# Altium project QSFP28 Mezzanine.PrjPcb (part 3 of 4)

## Sheet [08] - QSFP28_2.SchDoc: QSFP28 Module
size A3; Engineer: *ORCEL THYS; DocumentNumber: 5; SheetNumber: 5; SheetTotal: 14
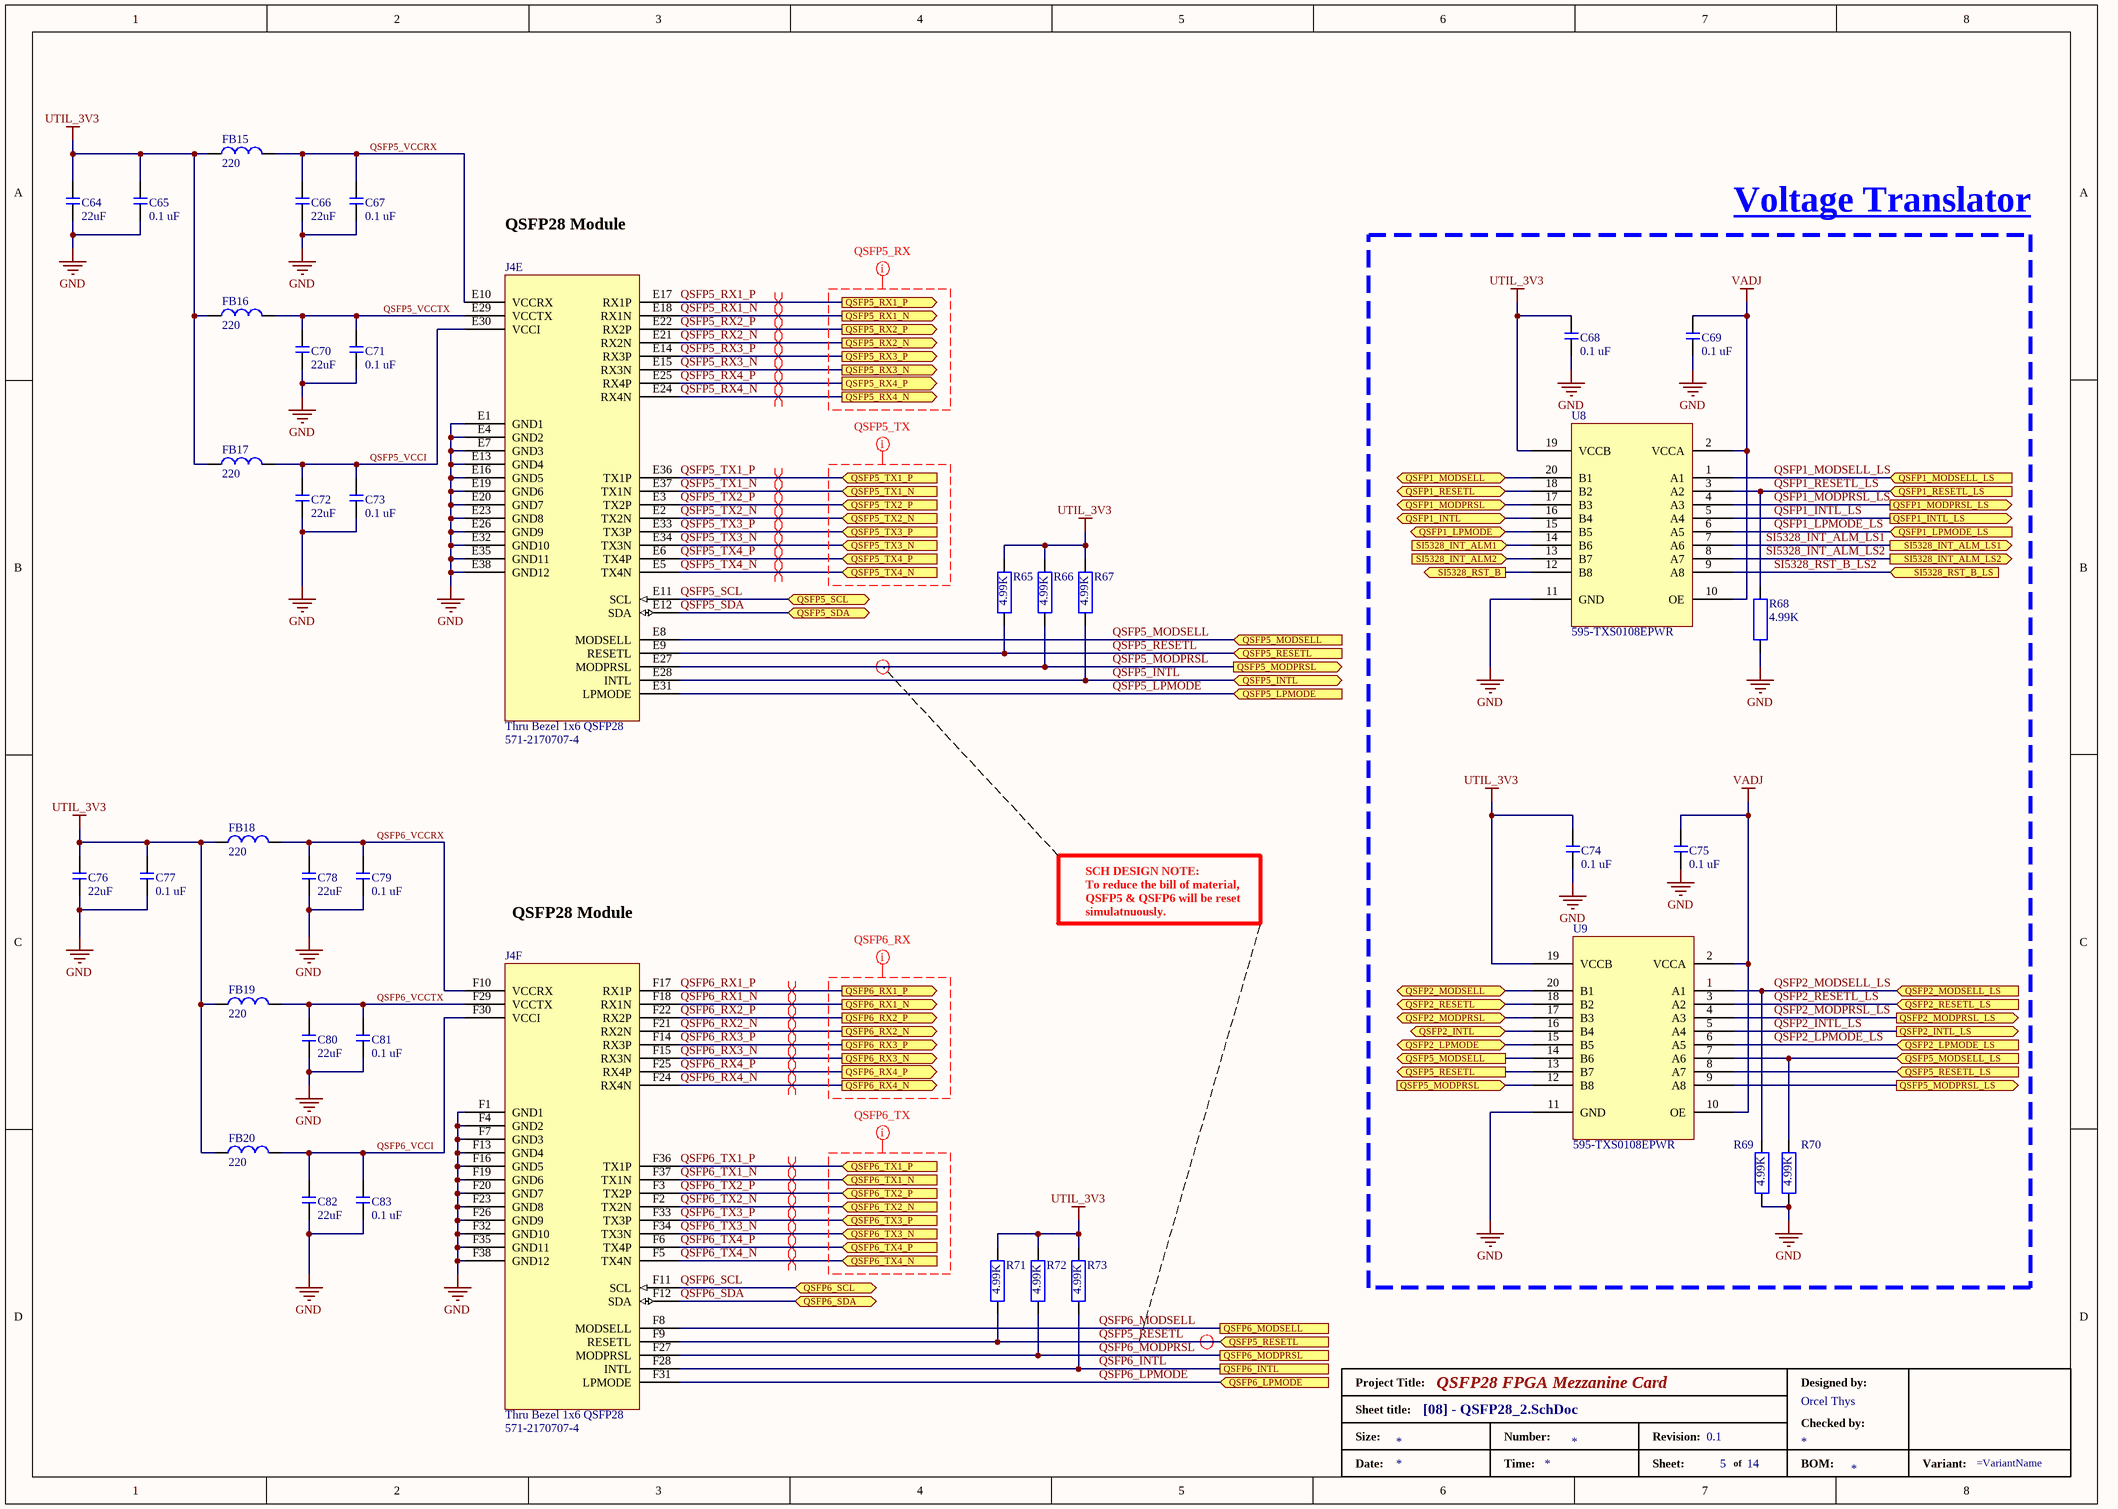
[diagram p7: [08] - QSFP28_2.SchDoc]

### Parts
(Parts that share a designator on the sheet are numbered #1, #2 ... from top to bottom, then left to right.)
*#9  DesignedBy: Orcel Thys  (hidden comment: Standard Title Block)  (graphical)
C64  22uF  [C2012]
C65  0.1 uF  [C0402]
C66  22uF  [C2012]
C67  0.1 uF  [C0402]
C68  0.1 uF  [C0402]
C69  0.1 uF  [C0402]
C70  22uF  [C2012]
C71  0.1 uF  [C0402]
C72  22uF  [C2012]
C73  0.1 uF  [C0402]
C74  0.1 uF  [C0402]
C75  0.1 uF  [C0402]
C76  22uF  [C2012]
C77  0.1 uF  [C0402]
C78  22uF  [C2012]
C79  0.1 uF  [C0402]
C80  22uF  [C2012]
C81  0.1 uF  [C0402]
C82  22uF  [C2012]
C83  0.1 uF  [C0402]
FB15  220  [BEADC1608X75N]
FB16  220  [BEADC1608X75N]
FB17  220  [BEADC1608X75N]
FB18  220  [BEADC1608X75N]
FB19  220  [BEADC1608X75N]
FB20  220  [BEADC1608X75N]
J4  Thru Bezel 1x6 QSFP28  Supplier Part Number 1: 571-2170707-4  [TE_2170707-4]  (parts E,F of 7)
R65  4.99K  [R0402]
R66  4.99K  [R0402]
R67  4.99K  [R0402]
R68  4.99K  [R0402]
R69  4.99K  [R0402]
R70  4.99K  [R0402]
R71  4.99K  [R0402]
R72  4.99K  [R0402]
R73  4.99K  [R0402]
U8  Supplier Part Number 1: 595-TXS0108EPWR  [SOP_65P640X120-20N]  (hidden comment: 8-bit voltage translator)
U9  Supplier Part Number 1: 595-TXS0108EPWR  [SOP_65P640X120-20N]  (hidden comment: 8-bit voltage translator)

### Blocks framed on the sheet
Voltage Translator: C68 C69 C74 C75 R68-R70 U8 U9

### Ports
QSFP1_INTL (bidir), QSFP1_INTL_LS (out), QSFP1_LPMODE (bidir), QSFP1_LPMODE_LS (in), QSFP1_MODPRSL (bidir), QSFP1_MODPRSL_LS (out), QSFP1_MODSELL (bidir), QSFP1_MODSELL_LS (in), QSFP1_RESETL (bidir), QSFP1_RESETL_LS (in), QSFP2_INTL (bidir), QSFP2_INTL_LS (out), QSFP2_LPMODE (bidir), QSFP2_LPMODE_LS (in), QSFP2_MODPRSL (bidir), QSFP2_MODPRSL_LS (out), QSFP2_MODSELL (bidir), QSFP2_MODSELL_LS (in), QSFP2_RESETL (bidir), QSFP2_RESETL_LS (in), QSFP5_INTL (bidir), QSFP5_LPMODE (in), QSFP5_MODPRSL (in), QSFP5_MODPRSL (out), QSFP5_MODPRSL_LS (out), QSFP5_MODSELL (in), QSFP5_MODSELL (out), QSFP5_MODSELL_LS (in), QSFP5_RESETL (in), QSFP5_RESETL (out), QSFP5_RESETL_LS (in), QSFP5_RX1_N (out), QSFP5_RX1_P (out), QSFP5_RX2_N (out), QSFP5_RX2_P (out), QSFP5_RX3_N (out), QSFP5_RX3_P (out), QSFP5_RX4_N (out), QSFP5_RX4_P (out), QSFP5_SCL (bidir), QSFP5_SDA (bidir), QSFP5_TX1_N (in), QSFP5_TX1_P (in), QSFP5_TX2_N (in), QSFP5_TX2_P (in), QSFP5_TX3_N (in), QSFP5_TX3_P (in), QSFP5_TX4_N (in), QSFP5_TX4_P (in), QSFP6_INTL, QSFP6_LPMODE (in), QSFP6_MODPRSL, QSFP6_MODSELL, QSFP6_RX1_N (out), QSFP6_RX1_P (out), QSFP6_RX2_N (out), QSFP6_RX2_P (out), QSFP6_RX3_N (out), QSFP6_RX3_P (out), QSFP6_RX4_N (out), QSFP6_RX4_P (out), QSFP6_SCL (bidir), QSFP6_SDA (bidir), QSFP6_TX1_N (in), QSFP6_TX1_P (in), QSFP6_TX2_N (in), QSFP6_TX2_P (in), QSFP6_TX3_N (in), QSFP6_TX3_P (in), QSFP6_TX4_N (in), QSFP6_TX4_P (in), SI5328_INT_ALM1 (in), SI5328_INT_ALM2 (in), SI5328_INT_ALM_LS1 (out), SI5328_INT_ALM_LS2 (out), SI5328_RST_B (out), SI5328_RST_B_LS (in)

### Nets
GND: C64.1 C65.1 C66.1 C67.1 C68.2 C69.1 C70.1 C71.1 C72.1 C73.1 C74.1 C75.1 C76.1 C77.1 C78.1 C79.1 C80.1 C81.1 C82.1 C83.1 J4.E1(GND1) J4.E4(GND2) J4.E7(GND3) J4.E13(GND4) J4.E16(GND5) J4.E19(GND6) J4.E20(GND7) J4.E23(GND8) J4.E26(GND9) J4.E32(GND10) J4.E35(GND11) J4.E38(GND12) J4.F1(GND1) J4.F4(GND2) J4.F7(GND3) J4.F13(GND4) J4.F16(GND5) J4.F19(GND6) J4.F20(GND7) J4.F23(GND8) J4.F26(GND9) J4.F32(GND10) J4.F35(GND11) J4.F38(GND12) R68.1 R69.1 R70.1 U8.11(GND) U9.11(GND)
UTIL_3V3: C64.2 C65.2 C68.1 C74.2 C76.2 C77.2 FB15.1 FB16.1 FB17.1 FB18.1 FB19.1 FB20.1 R65.2 R66.2 R67.2 R71.2 R72.2 R73.2 U8.19(VCCB) U9.19(VCCB)
VADJ: C69.2 C75.2 U8.2(VCCA) U8.10(OE) U9.2(VCCA) U9.10(OE)
QSFP1_INTL: U8.16(B4) ; port QSFP1_INTL
QSFP1_INTL_LS: U8.5(A4) ; port QSFP1_INTL_LS
QSFP1_LPMODE: U8.15(B5) ; port QSFP1_LPMODE
QSFP1_LPMODE_LS: U8.6(A5) ; port QSFP1_LPMODE_LS
QSFP1_MODPRSL: U8.17(B3) ; port QSFP1_MODPRSL
QSFP1_MODPRSL_LS: U8.4(A3) ; port QSFP1_MODPRSL_LS
QSFP1_MODSELL: U8.20(B1) ; port QSFP1_MODSELL
QSFP1_MODSELL_LS: U8.1(A1) ; port QSFP1_MODSELL_LS
QSFP1_RESETL: U8.18(B2) ; port QSFP1_RESETL
QSFP1_RESETL_LS: R68.2 U8.3(A2) ; port QSFP1_RESETL_LS
QSFP2_INTL: U9.16(B4) ; port QSFP2_INTL
QSFP2_INTL_LS: U9.5(A4) ; port QSFP2_INTL_LS
QSFP2_LPMODE: U9.15(B5) ; port QSFP2_LPMODE
QSFP2_LPMODE_LS: U9.6(A5) ; port QSFP2_LPMODE_LS
QSFP2_MODPRSL: U9.17(B3) ; port QSFP2_MODPRSL
QSFP2_MODPRSL_LS: U9.4(A3) ; port QSFP2_MODPRSL_LS
QSFP2_MODSELL: U9.20(B1) ; port QSFP2_MODSELL
QSFP2_MODSELL_LS: R69.2 U9.1(A1) ; port QSFP2_MODSELL_LS
QSFP2_RESETL: U9.18(B2) ; port QSFP2_RESETL
QSFP2_RESETL_LS: U9.3(A2) ; port QSFP2_RESETL_LS
QSFP5_INTL: J4.E28(INTL) R67.1 ; port QSFP5_INTL
QSFP5_LPMODE: J4.E31(LPMODE) ; port QSFP5_LPMODE
QSFP5_MODPRSL: J4.E27(MODPRSL) R66.1 U9.12(B8) ; port QSFP5_MODPRSL
QSFP5_MODSELL: J4.E8(MODSELL) U9.14(B6) ; port QSFP5_MODSELL
QSFP5_RESETL: J4.E9(RESETL) J4.F9(RESETL) R65.1 R71.1 U9.13(B7) ; port QSFP5_RESETL
QSFP5_RX1_N: J4.E18(RX1N) ; port QSFP5_RX1_N
QSFP5_RX1_P: J4.E17(RX1P) ; port QSFP5_RX1_P
QSFP5_RX2_N: J4.E21(RX2N) ; port QSFP5_RX2_N
QSFP5_RX2_P: J4.E22(RX2P) ; port QSFP5_RX2_P
QSFP5_RX3_N: J4.E15(RX3N) ; port QSFP5_RX3_N
QSFP5_RX3_P: J4.E14(RX3P) ; port QSFP5_RX3_P
QSFP5_RX4_N: J4.E24(RX4N) ; port QSFP5_RX4_N
QSFP5_RX4_P: J4.E25(RX4P) ; port QSFP5_RX4_P
QSFP5_SCL: J4.E11(SCL) ; port QSFP5_SCL
QSFP5_SDA: J4.E12(SDA) ; port QSFP5_SDA
QSFP5_TX1_N: J4.E37(TX1N) ; port QSFP5_TX1_N
QSFP5_TX1_P: J4.E36(TX1P) ; port QSFP5_TX1_P
QSFP5_TX2_N: J4.E2(TX2N) ; port QSFP5_TX2_N
QSFP5_TX2_P: J4.E3(TX2P) ; port QSFP5_TX2_P
QSFP5_TX3_N: J4.E34(TX3N) ; port QSFP5_TX3_N
QSFP5_TX3_P: J4.E33(TX3P) ; port QSFP5_TX3_P
QSFP5_TX4_N: J4.E5(TX4N) ; port QSFP5_TX4_N
QSFP5_TX4_P: J4.E6(TX4P) ; port QSFP5_TX4_P
QSFP5_VCCI: C72.2 C73.2 FB17.2 J4.E30(VCCI)
QSFP5_VCCRX: C66.2 C67.2 FB15.2 J4.E10(VCCRX)
QSFP5_VCCTX: C70.2 C71.2 FB16.2 J4.E29(VCCTX)
QSFP6_INTL: J4.F28(INTL) R73.1 ; port QSFP6_INTL
QSFP6_LPMODE: J4.F31(LPMODE) ; port QSFP6_LPMODE
QSFP6_MODPRSL: J4.F27(MODPRSL) R72.1 ; port QSFP6_MODPRSL
QSFP6_MODSELL: J4.F8(MODSELL) ; port QSFP6_MODSELL
QSFP6_RX1_N: J4.F18(RX1N) ; port QSFP6_RX1_N
QSFP6_RX1_P: J4.F17(RX1P) ; port QSFP6_RX1_P
QSFP6_RX2_N: J4.F21(RX2N) ; port QSFP6_RX2_N
QSFP6_RX2_P: J4.F22(RX2P) ; port QSFP6_RX2_P
QSFP6_RX3_N: J4.F15(RX3N) ; port QSFP6_RX3_N
QSFP6_RX3_P: J4.F14(RX3P) ; port QSFP6_RX3_P
QSFP6_RX4_N: J4.F24(RX4N) ; port QSFP6_RX4_N
QSFP6_RX4_P: J4.F25(RX4P) ; port QSFP6_RX4_P
QSFP6_SCL: J4.F11(SCL) ; port QSFP6_SCL
QSFP6_SDA: J4.F12(SDA) ; port QSFP6_SDA
QSFP6_TX1_N: J4.F37(TX1N) ; port QSFP6_TX1_N
QSFP6_TX1_P: J4.F36(TX1P) ; port QSFP6_TX1_P
QSFP6_TX2_N: J4.F2(TX2N) ; port QSFP6_TX2_N
QSFP6_TX2_P: J4.F3(TX2P) ; port QSFP6_TX2_P
QSFP6_TX3_N: J4.F34(TX3N) ; port QSFP6_TX3_N
QSFP6_TX3_P: J4.F33(TX3P) ; port QSFP6_TX3_P
QSFP6_TX4_N: J4.F5(TX4N) ; port QSFP6_TX4_N
QSFP6_TX4_P: J4.F6(TX4P) ; port QSFP6_TX4_P
QSFP6_VCCI: C82.2 C83.2 FB20.2 J4.F30(VCCI)
QSFP6_VCCRX: C78.2 C79.2 FB18.2 J4.F10(VCCRX)
QSFP6_VCCTX: C80.2 C81.2 FB19.2 J4.F29(VCCTX)
SI5328_INT_ALM_LS1: U8.7(A6) ; port SI5328_INT_ALM_LS1
SI5328_INT_ALM_LS2: U8.8(A7) ; port SI5328_INT_ALM_LS2
SI5328_RST_B_LS2: U8.9(A8) ; port SI5328_RST_B_LS
NetJ1_G21: R70.2 U9.7(A6) ; port QSFP5_MODSELL_LS
NetJ1_H22: U9.9(A8) ; port QSFP5_MODPRSL_LS
NetJ1_H23: U9.8(A7) ; port QSFP5_RESETL_LS
NetU6_1: U8.12(B8) ; port SI5328_RST_B
NetU6_3: U8.14(B6) ; port SI5328_INT_ALM1
NetU7_3: U8.13(B7) ; port SI5328_INT_ALM2

### Layout directives
mark named QSFP5_RX: (no net found under the mark)
mark named QSFP5_TX: (no net found under the mark)
mark named QSFP6_RX: (no net found under the mark)
mark named QSFP6_TX: (no net found under the mark)
differential pair: QSFP5_RX1_N, QSFP5_RX1_P, QSFP5_RX2_N, QSFP5_RX2_P, QSFP5_RX3_N, QSFP5_RX3_P, QSFP5_RX4_N, QSFP5_RX4_P, QSFP5_TX1_N, QSFP5_TX1_P, QSFP5_TX2_N, QSFP5_TX2_P, QSFP5_TX3_N, QSFP5_TX3_P, QSFP5_TX4_N, QSFP5_TX4_P, QSFP6_RX1_N, QSFP6_RX1_P, QSFP6_RX2_N, QSFP6_RX2_P, QSFP6_RX3_N, QSFP6_RX3_P, QSFP6_RX4_N, QSFP6_RX4_P, QSFP6_TX1_N, QSFP6_TX1_P, QSFP6_TX2_N, QSFP6_TX2_P, QSFP6_TX3_N, QSFP6_TX3_P, QSFP6_TX4_N, QSFP6_TX4_P

### Notes on the sheet
- QSFP28 Module
- SCH DESIGN NOTE:
  To reduce the bill of material, QSFP5 & QSFP6 will be reset simulatnuously.
- Title
- Size:
- Date:
- A4
- Number:
- Time:
- Revision:
- Sheet
- of
- File:
- (in symbol Title_Block) Project Title:; Designed by:; Sheet title:; Checked by:; Size:; Number:; Revision:; Date:; Time:; Sheet:; of; BOM:; Variant:

### Library data of the parts
*#9 = Title_Block: Size: *; BOM: *; DW: *; CheckedBy: *
C64 C66 C70 C72 C76 C78 C80 C82 = C2012X5R1V226M125AC: Cap Series 0805 22 uF 35 V ±20 % Tolerance X5R SMT Multilayer Ceramic Capacitor; Manufacturer: TDK; Tolerance: 20%; Voltage Rating: 35V; Supplier 1: Rs; Manufacturer Part Number: C2012X5R1V226M125AC; RoHS: Yes; Category: Ceramic Capacitors; Stock 1: 15560; Pricing 1: 50=0.544, 100=0.502, 250=0.458, 500=0.418 (EUR); Mount: Surface Mount; Case/Package: 0805; Case Code (Metric): 2012; Case Code (Imperial): 0805; Weight: 0.000194oz; Dielectric Material: Ceramic; Min Operating Temperature: -55°C; Max Operating Temperature: 85°C; Package Quantity: 1; Packaging: Tape and Reel; Capacitance: 22uF; Dielectric: X5R; Termination: SMD/SMT; Voltage Rating (DC): 35V; Series: C; Length: 0.079inch; Width: 0.049inch; Height: 1.25mm; Thickness: 0.057inch; Reach SVHC Compliant: No; Lead Free: Lead Free; RoHS Compliant: Yes; ComponentLink1URL: https://datasheet.ciiva.com/14893/tdkmlcccaprange-14893109.pdf?src-supplier=Digi-Key; ComponentLink1Description: https://datasheet.ciiva.com/14893/tdkmlcccaprange-14893109.pdf?src-supplier=Digi-Key; ComponentLink2URL: https://datasheet.ciiva.com/14893/tdkmlcccaprange-14893110.pdf?src-supplier=Digi-Key; ComponentLink2Description: https://datasheet.ciiva.com/14893/tdkmlcccaprange-14893110.pdf?src-supplier=Digi-Key; ComponentLink3URL: https://datasheet.ciiva.com/14893/tdkmlcccaprange-14893111.pdf?src-supplier=Digi-Key; ComponentLink3Description: https://datasheet.ciiva.com/14893/tdkmlcccaprange-14893111.pdf?src-supplier=Digi-Key; Supplier Part Number 1: 9159334P
C65 C67-C69 C71 C73-C75 C77 C79 C81 C83 = UMK105B7104KV-FR: Cap 0402 0.1 uF 50 V ±10 % Tolerance X7R Surface Mount Multilayer Ceramic Capacitor; Manufacturer: Taiyo Yuden; Voltage Rating: 50V; Capacitance: 100nF; Tolerance: 10%; Supplier 1: Rs; Manufacturer Part Number: UMK105B7104KV-FR; RoHS: Yes; Category: Ceramic Capacitors; Stock 1: 60000; Pricing 1: 10000=0.016 (EUR); Mount: Surface Mount; Case/Package: 0402; Case Code (Imperial): 0402; Case Code (Metric): 1005; Min Operating Temperature: -55°C; Max Operating Temperature: 125°C; Voltage Rating (DC): 50V; Packaging: Tape and Reel; Package Quantity: 1; Dielectric: X7R; Termination: SMD/SMT; Series: M; Length: 0.039inch; Width: 0.02inch; Height: 0.5mm; Thickness: 0.022inch; Lead Free: Lead Free; Halogen Free: Halogen Free; RoHS Compliant: Yes; ComponentLink1URL: https://datasheet.ciiva.com/24356/619umk105b7104kv-fr-24356845.pdf?src-supplier=Onlinecomponents.com; ComponentLink1Description: https://datasheet.ciiva.com/24356/619umk105b7104kv-fr-24356845.pdf?src-supplier=Onlinecomponents.com; ComponentLink2URL: https://datasheet.ciiva.com/30180/52umk105b7104kv-fr-30180098.pdf?src-supplier=Onlinecomponents.com; ComponentLink2Description: https://datasheet.ciiva.com/30180/52umk105b7104kv-fr-30180098.pdf?src-supplier=Onlinecomponents.com; ComponentLink3URL: https://datasheet.ciiva.com/18697/mlcc-all-e-18697452.pdf?src-supplier=Digi-Key; ComponentLink3Description: https://datasheet.ciiva.com/18697/mlcc-all-e-18697452.pdf?src-supplier=Digi-Key; ComponentLink4URL: https://datasheet.ciiva.com/18697/mlcc-all-e-18697451.pdf?src-supplier=Digi-Key; ComponentLink4Description: https://datasheet.ciiva.com/18697/mlcc-all-e-18697451.pdf?src-supplier=Digi-Key; ComponentLink5URL: https://datasheet.ciiva.com/18697/mlcc-all-e-18697453.pdf?src-supplier=Digi-Key; ComponentLink5Description: https://datasheet.ciiva.com/18697/mlcc-all-e-18697453.pdf?src-supplier=Digi-Key; Supplier Part Number 1: 1782869
FB15-FB20 = MPZ1608S221ATA00: 0603 220Ω ±25% DCR=0.050Ω 2.2A; Manufacturer: TDK; Core Material: Ferrite; Impedance: 220R; DC Resistance (DCR): 50mR; Number of Lines: 1; Supplier 1: Farnell; Manufacturer Part Number: MPZ1608S221ATA00; RoHS: Yes; Category: Ferrite Beads and Chips; Stock 1: 256000; Pricing 1: 4000=0.0235, 20000=0.023, 40000=0.0226 (EUR); Mount: Surface Mount; Case/Package: 0603; Number of Pins: 2; Case Code (Imperial): 0603; Case Code (Metric): 1608; Tolerance: 25%; Packaging: Cut Tape; Package Quantity: 1; Max DC Current: 2.2A; Series: MPZ; Current Rating: 2.2A; Max Current Rating: 2.2A; Length: 0.063inch; Width: 0.031inch; Height: 0.037inch; RoHS Compliant: Yes; Lead Free: Lead Free; Reach SVHC Compliant: No; ComponentLink1URL: https://datasheet.ciiva.com/8077/55167-8077073.pdf?src-supplier=Element14; ComponentLink1Description: https://datasheet.ciiva.com/8077/55167-8077073.pdf?src-supplier=Element14; ComponentLink2URL: https://datasheet.ciiva.com/8077/55167-8077071.pdf?src-supplier=Element14; ComponentLink2Description: https://datasheet.ciiva.com/8077/55167-8077071.pdf?src-supplier=Element14; ComponentLink3URL: https://datasheet.ciiva.com/46381/1486324-46381628.pdf?src-supplier=Element14; ComponentLink3Description: https://datasheet.ciiva.com/46381/1486324-46381628.pdf?src-supplier=Element14; ComponentLink4URL: https://datasheet.ciiva.com/46366/print-detail-pdf-phplangenpart-nompz1608s221ata00nreimp-unit-xmhz-46366044.pdf?src-supplier=Onlinecomponents.com; ComponentLink4Description: https://datasheet.ciiva.com/46366/print-detail-pdf-phplangenpart-nompz1608s221ata00nreimp-unit-xmhz-46366044.pdf?src-supplier=Onlinecomponents.com; Supplier Part Number 1: 2800773
J4 = 2170707-4: Cage Assy, 1X6, QSFP28, Spring, Hs; Manufacturer: TE Connectivity AMP; Supplier 1: Mouser; Manufacturer Part Number: 2170707-4; RoHS: Yes; Category: Connectors; Stock 1: 60; Pricing 1: 1=80.77, 10=80.77, 50=71.27, 100=70.28, 1000=67.22, 10000=67.22 (USD); ComponentLink1URL: https://www.te.com/commerce/DocumentDelivery/DDEController?Action=srchrtrv&DocNm=2170707&DocType=Customer+Drawing&DocLang=English&src-supplier=Digi-Key; ComponentLink1Description: https://www.te.com/commerce/DocumentDelivery/DDEController?Action=srchrtrv&DocNm=2170707&DocType=Customer+Drawing&DocLang=English&src-supplier=Digi-Key
R65-R73 = ERJ-2RKF4991X: RES SMD 4.99K OHM 1% 1/10W 0402; Manufacturer: Panasonic; Resistance: 4.99kR; Power Rating: 100mW; Voltage Rating: 50V; Temperature Coefficient: 100ppm/°C; Supplier 1: Mouser; Manufacturer Part Number: ERJ-2RKF4991X; RoHS: Yes; Category: Chip SMD Resistors; Stock 1: 1218727; Pricing 1: 1=0.1, 10=0.018, 50=0.018, 100=0.008, 1000=0.006, 10000=0.004 (USD); Mount: Surface Mount; Case/Package: 0402; Case Code (Metric): 1005; Case Code (Imperial): 0402; Contact Plating: Tin; Weight: 2.8E-05oz; Min Operating Temperature: -55°C; Max Operating Temperature: 155°C; Tolerance: 1%; Packaging: Tape and Reel; Package Quantity: 1; Resistor Type: Thick Film; Number of Terminations: 2; Termination: SMD/SMT; Max Power Dissipation: 100mW; Voltage Rating (DC): 50V; Features: Automotive AEC-Q200; Series: ERJ; Resistance Tolerance: 1%; Construction: Rectangular; Working Voltage: 50V; Technology: THICK FILM; Length: 1mm; Width: 0.5mm; Height: 0.016inch; Depth: 0.5mm; Radiation Hardening: No; Reach SVHC Compliant: No; Military Standard: Not; Lead Free: Lead Free; RoHS Compliant: Yes; ComponentLink1URL: https://datasheet.ciiva.com/46388/426256-46388311.pdf?src-supplier=Element14; ComponentLink1Description: https://datasheet.ciiva.com/46388/426256-46388311.pdf?src-supplier=Element14; ComponentLink2URL: https://datasheet.ciiva.com/46376/426256-46376955.pdf?src-supplier=Element14; ComponentLink2Description: https://datasheet.ciiva.com/46376/426256-46376955.pdf?src-supplier=Element14; ComponentLink3URL: https://datasheet.ciiva.com/22749/1678782-22749654.pdf?src-supplier=Element14; ComponentLink3Description: https://datasheet.ciiva.com/22749/1678782-22749654.pdf?src-supplier=Element14; ComponentLink4URL: https://datasheet.ciiva.com/24158/aoa0000ce2-24158871.pdf?src-supplier=Mouser; ComponentLink4Description: https://datasheet.ciiva.com/24158/aoa0000ce2-24158871.pdf?src-supplier=Mouser; ComponentLink5URL: https://datasheet.ciiva.com/16775/70260748-16775018.pdf?src-supplier=Allied+Electronics; ComponentLink5Description: https://datasheet.ciiva.com/16775/70260748-16775018.pdf?src-supplier=Allied+Electronics; ComponentLink6URL: https://datasheet.ciiva.com/16773/70260748-16773110.pdf?src-supplier=Allied+Electronics; ComponentLink6Description: https://datasheet.ciiva.com/16773/70260748-16773110.pdf?src-supplier=Allied+Electronics; ComponentLink7URL: https://datasheet.ciiva.com/16199/aoa0000ce2-16199546.pdf?src-supplier=Future+Electronics; ComponentLink7Description: https://datasheet.ciiva.com/16199/aoa0000ce2-16199546.pdf?src-supplier=Future+Electronics; Supplier Part Number 1: 667-ERJ-2RKF4991X
U8 U9 = TXS0108EPWR: IC 8BIT NON-INV TRANSLTR 20TSSOP; Manufacturer: Texas Instruments; Data Rate: 60Mbps; Number of Bits: 8; Propagation Delay: 4.8ns; Min Supply Voltage: 1.2V; Max Supply Voltage: 5.5V; High Level Output Current: -50mA; Low Level Output Current: 50mA; Turn-On Delay Time: 312ns; Quiescent Current: 3uA; Channel Type: Bidirectional; Number of Circuits: 1; Output Current: 620uA; Rise Time: 6.3ns; Supply Current: 8uA; Supplier 1: Mouser; Manufacturer Part Number: TXS0108EPWR; RoHS: Yes; Category: Voltage Level Shifters; Stock 1: 220045; Pricing 1: 1=1.57, 10=1.41, 50=1.33, 100=1.13, 1000=0.772, 10000=0.702 (USD); Mount: Surface Mount; Case/Package: TSSOP; Number of Pins: 20; Weight: 0.002716oz; Min Operating Temperature: -40°C; Max Operating Temperature: 85°C; Packaging: Tape and Reel; Series: -; Number of Channels: 8; Logic Function: Translator; Number of Inputs: 8; Package Quantity: 2000; Termination: SMD/SMT; Radiation Hardening: No; Lead Free: Lead Free; RoHS Compliant: Yes; Reach SVHC Compliant: No; ComponentLink1URL: https://datasheet.ciiva.com/14287/txs0108e-14287280.pdf?src-supplier=Farnell; ComponentLink1Description: https://datasheet.ciiva.com/14287/txs0108e-14287280.pdf?src-supplier=Farnell; ComponentLink2URL: https://datasheet.ciiva.com/28653/1714661-28653429.pdf?src-supplier=Element14; ComponentLink2Description: https://datasheet.ciiva.com/28653/1714661-28653429.pdf?src-supplier=Element14; ComponentLink3URL: https://datasheet.ciiva.com/4834/sces642b-127094-4834401.pdf?src-supplier=Mouser; ComponentLink3Description: https://datasheet.ciiva.com/4834/sces642b-127094-4834401.pdf?src-supplier=Mouser; ComponentLink4URL: https://datasheet.ciiva.com/15096/getdatasheetpartid-322119-15096276.pdf?src-supplier=Verical; ComponentLink4Description: https://datasheet.ciiva.com/15096/getdatasheetpartid-322119-15096276.pdf?src-supplier=Verical; ComponentLink5URL: https://datasheet.ciiva.com/1508/1815244-1508732.pdf?src-supplier=Element14; ComponentLink5Description: https://datasheet.ciiva.com/1508/1815244-1508732.pdf?src-supplier=Element14; ComponentLink6URL: https://datasheet.ciiva.com/1899/txs0108e-1899605.pdf?src-supplier=Digi-Key; ComponentLink6Description: https://datasheet.ciiva.com/1899/txs0108e-1899605.pdf?src-supplier=Digi-Key; ComponentLink7URL: https://datasheet.ciiva.com/1899/txs0108e-1899604.pdf?src-supplier=Digi-Key; ComponentLink7Description: https://datasheet.ciiva.com/1899/txs0108e-1899604.pdf?src-supplier=Digi-Key; ComponentLink8URL: https://datasheet.ciiva.com/1899/txs0108e-1899606.pdf?src-supplier=Digi-Key; ComponentLink8Description: https://datasheet.ciiva.com/1899/txs0108e-1899606.pdf?src-supplier=Digi-Key; ComponentLink9URL: https://datasheet.ciiva.com/14287/txs0108e-14287532.pdf?src-supplier=Avnet; ComponentLink9Description: https://datasheet.ciiva.com/14287/txs0108e-14287532.pdf?src-supplier=Avnet

## Sheet [09] - Mechanical.SchDoc: QSFP28 Module
size A3; Engineer: *ORCEL THYS; DocumentNumber: 6; SheetNumber: 6; SheetTotal: 14
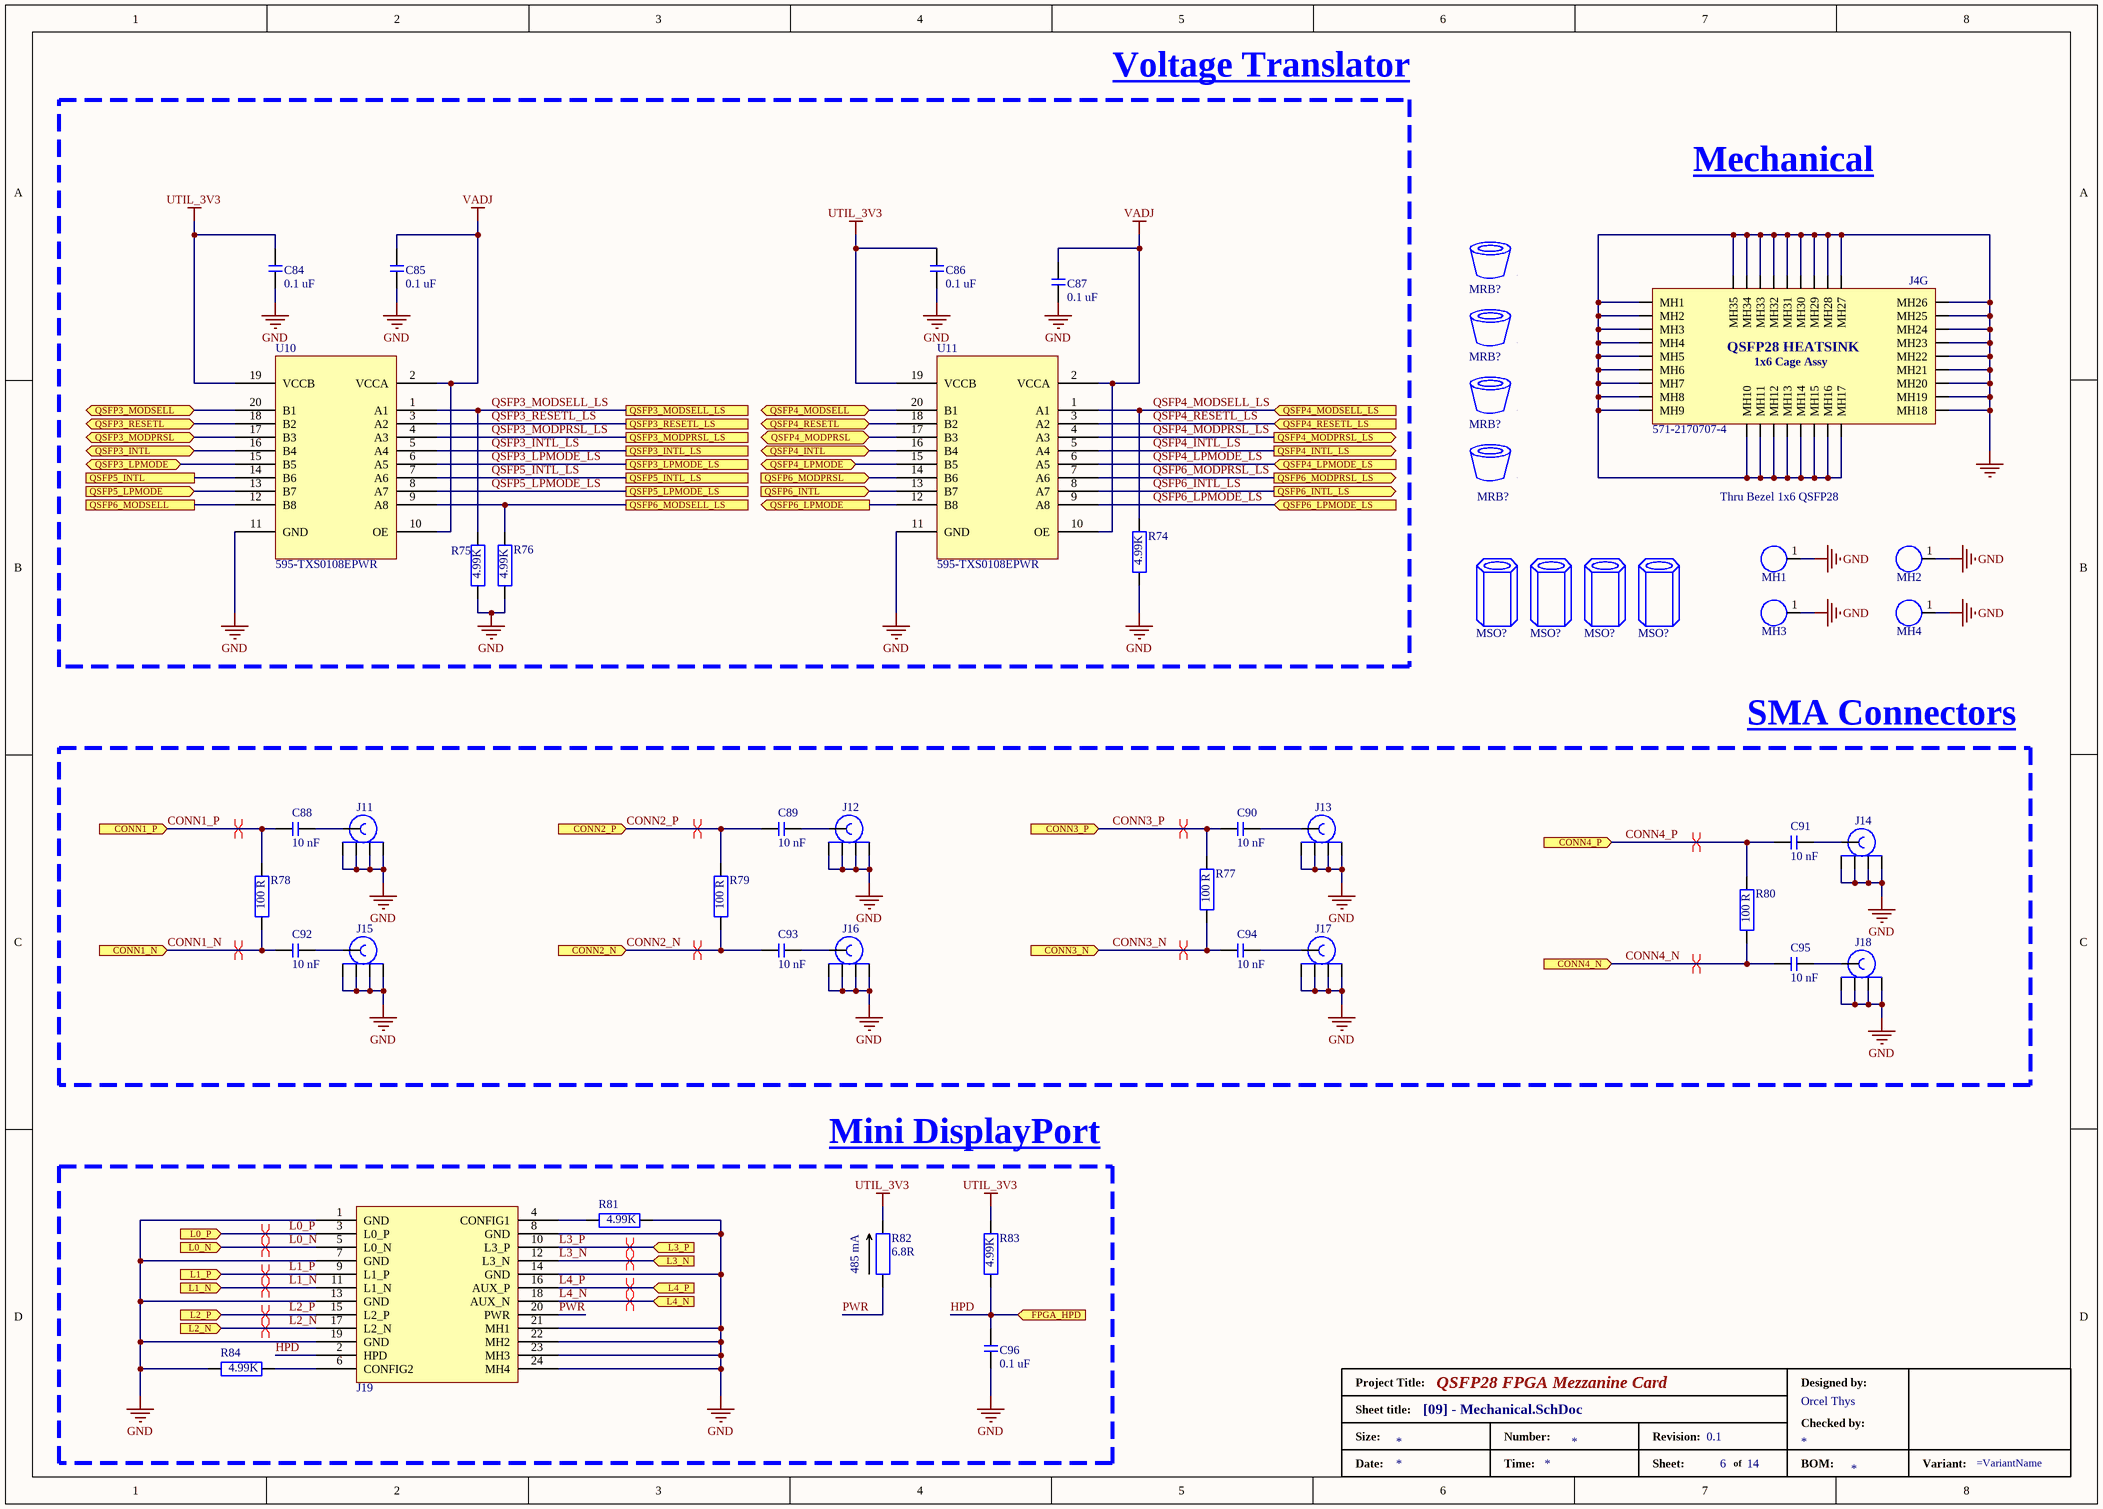
[diagram p8: [09] - Mechanical.SchDoc]

### Parts
(Parts that share a designator on the sheet are numbered #1, #2 ... from top to bottom, then left to right.)
*#10  DesignedBy: Orcel Thys  (hidden comment: Standard Title Block)  (graphical)
C84  0.1 uF  [C0402]
C85  0.1 uF  [C0402]
C86  0.1 uF  [C0402]
C87  0.1 uF  [C0402]
C88  10 nF  [C0402]
C89  10 nF  [C0402]
C90  10 nF  [C0402]
C91  10 nF  [C0402]
C92  10 nF  [C0402]
C93  10 nF  [C0402]
C94  10 nF  [C0402]
C95  10 nF  [C0402]
C96  0.1 uF  [C0402]
J4  Thru Bezel 1x6 QSFP28  Supplier Part Number 1: 571-2170707-4  [TE_2170707-4]  (part G of 7)
J11  SMA-J-P-H_ST-EM1  [SAMTEC_SMA-J-P-H-ST-EM1]  (value not drawn)
J12  SMA-J-P-H_ST-EM1  [SAMTEC_SMA-J-P-H-ST-EM1]  (value not drawn)
J13  SMA-J-P-H_ST-EM1  [SAMTEC_SMA-J-P-H-ST-EM1]  (value not drawn)
J14  SMA-J-P-H_ST-EM1  [SAMTEC_SMA-J-P-H-ST-EM1]  (value not drawn)
J15  SMA-J-P-H_ST-EM1  [SAMTEC_SMA-J-P-H-ST-EM1]  (value not drawn)
J16  SMA-J-P-H_ST-EM1  [SAMTEC_SMA-J-P-H-ST-EM1]  (value not drawn)
J17  SMA-J-P-H_ST-EM1  [SAMTEC_SMA-J-P-H-ST-EM1]  (value not drawn)
J18  SMA-J-P-H_ST-EM1  [SAMTEC_SMA-J-P-H-ST-EM1]  (value not drawn)
J19  Mini DisplayPort  [MiniDP_2129320-3]  (value not drawn)
MH1  Mountimg Hole  [MH_250H125]  (value not drawn)
MH2  Mountimg Hole  [MH_250H125]  (value not drawn)
MH3  Mountimg Hole  [MH_250H125]  (value not drawn)
MH4  Mountimg Hole  [MH_250H125]  (value not drawn)
MRB?#1  Rubber Bumper  (value not drawn)  (graphical)
MRB?#2  Rubber Bumper  (value not drawn)  (graphical)
MRB?#3  Rubber Bumper  (value not drawn)  (graphical)
MRB?#4  Rubber Bumper  (value not drawn)  (graphical)
MSO?#1  4-40 0.375" ALUM STANDOFF  (value not drawn)  (graphical)
MSO?#2  4-40 0.375" ALUM STANDOFF  (value not drawn)  (graphical)
MSO?#3  4-40 0.375" ALUM STANDOFF  (value not drawn)  (graphical)
MSO?#4  4-40 0.375" ALUM STANDOFF  (value not drawn)  (graphical)
R74  4.99K  [R0402]
R75  4.99K  [R0402]
R76  4.99K  [R0402]
R77  100 R  [R0402]
R78  100 R  [R0402]
R79  100 R  [R0402]
R80  100 R  [R0402]
R81  4.99K  [R0402]
R82  6.8R  [RESC6331X70N]
R83  4.99K  [R0402]
R84  4.99K  [R0402]
U10  Supplier Part Number 1: 595-TXS0108EPWR  [SOP_65P640X120-20N]  (hidden comment: 8-bit voltage translator)
U11  Supplier Part Number 1: 595-TXS0108EPWR  [SOP_65P640X120-20N]  (hidden comment: 8-bit voltage translator)

### Blocks framed on the sheet
Voltage Translator: C84-C87 R74-R76 U10 U11
SMA Connectors: C88-C95 J11-J18 R77-R80
Mini DisplayPort: C96 J19 R81-R84

### Ports
CONN1_N (in), CONN1_P (in), CONN2_N (in), CONN2_P (in), CONN3_N (in), CONN3_P (in), CONN4_N (in), CONN4_P (in), FPGA_HPD (in), L0_N (in), L0_P (in), L1_N (in), L1_P (in), L2_N (in), L2_P (in), L3_N (in), L3_P (in), L4_N (in), L4_P (in), QSFP3_INTL (bidir), QSFP3_INTL_LS, QSFP3_LPMODE (bidir), QSFP3_LPMODE_LS, QSFP3_MODPRSL (bidir), QSFP3_MODPRSL_LS, QSFP3_MODSELL (bidir), QSFP3_MODSELL_LS, QSFP3_RESETL (bidir), QSFP3_RESETL_LS, QSFP4_INTL (bidir), QSFP4_INTL_LS (out), QSFP4_LPMODE (bidir), QSFP4_LPMODE_LS (in), QSFP4_MODPRSL (bidir), QSFP4_MODPRSL_LS (out), QSFP4_MODSELL (bidir), QSFP4_MODSELL_LS (in), QSFP4_RESETL (bidir), QSFP4_RESETL_LS (in), QSFP5_INTL, QSFP5_INTL_LS, QSFP5_LPMODE (in), QSFP5_LPMODE_LS, QSFP6_INTL (in), QSFP6_INTL_LS (out), QSFP6_LPMODE (out), QSFP6_LPMODE_LS (in), QSFP6_MODPRSL (in), QSFP6_MODPRSL_LS (out), QSFP6_MODSELL, QSFP6_MODSELL_LS

### Nets
GND: C84.1 C85.1 C86.1 C87.1 C96.1 J4.MH1 J4.MH2 J4.MH3 J4.MH4 J4.MH5 J4.MH6 J4.MH7 J4.MH8 J4.MH9 J4.MH10 J4.MH11 J4.MH12 J4.MH13 J4.MH14 J4.MH15 J4.MH16 J4.MH17 J4.MH18 J4.MH19 J4.MH20 J4.MH21 J4.MH22 J4.MH23 J4.MH24 J4.MH25 J4.MH26 J4.MH27 J4.MH28 J4.MH29 J4.MH30 J4.MH31 J4.MH32 J4.MH33 J4.MH34 J4.MH35 J11.2 J11.3 J11.4 J11.5 J12.2 J12.3 J12.4 J12.5 J13.2 J13.3 J13.4 J13.5 J14.2 J14.3 J14.4 J14.5 J15.2 J15.3 J15.4 J15.5 J16.2 J16.3 J16.4 J16.5 J17.2 J17.3 J17.4 J17.5 J18.2 J18.3 J18.4 J18.5 J19.1(GND) J19.7(GND) J19.8(GND) J19.13(GND) J19.14(GND) J19.19(GND) J19.21(MH1) J19.22(MH2) J19.23(MH3) J19.24(MH4) MH1.1(MH) MH2.1(MH) MH3.1(MH) MH4.1(MH) R74.1 R75.1 R76.1 R81.1 R84.1 U10.11(GND) U11.11(GND)
UTIL_3V3: C84.2 C86.2 R82.2 R83.2 U10.19(VCCB) U11.19(VCCB)
VADJ: C85.2 C87.2 U10.2(VCCA) U10.10(OE) U11.2(VCCA) U11.10(OE)
CONN1_N: C92.1 R78.1 ; port CONN1_N
CONN1_P: C88.1 R78.2 ; port CONN1_P
CONN2_N: C93.1 R79.1 ; port CONN2_N
CONN2_P: C89.1 R79.2 ; port CONN2_P
CONN3_N: C94.1 R77.1 ; port CONN3_N
CONN3_P: C90.2 R77.2 ; port CONN3_P
CONN4_N: C95.1 R80.1 ; port CONN4_N
CONN4_P: C91.1 R80.2 ; port CONN4_P
HPD: C96.2 J19.2(HPD) R83.1 ; port FPGA_HPD
L0_N: J19.5(L0_N) ; port L0_N
L0_P: J19.3(L0_P) ; port L0_P
L1_N: J19.11(L1_N) ; port L1_N
L1_P: J19.9(L1_P) ; port L1_P
L2_N: J19.17(L2_N) ; port L2_N
L2_P: J19.15(L2_P) ; port L2_P
L3_N: J19.12(L3_N) ; port L3_N
L3_P: J19.10(L3_P) ; port L3_P
L4_N: J19.18(AUX_N) ; port L4_N
L4_P: J19.16(AUX_P) ; port L4_P
PWR: J19.20(PWR) R82.1
QSFP3_INTL: U10.16(B4) ; port QSFP3_INTL
QSFP3_INTL_LS: U10.5(A4) ; port QSFP3_INTL_LS
QSFP3_LPMODE: U10.15(B5) ; port QSFP3_LPMODE
QSFP3_LPMODE_LS: U10.6(A5) ; port QSFP3_LPMODE_LS
QSFP3_MODPRSL: U10.17(B3) ; port QSFP3_MODPRSL
QSFP3_MODPRSL_LS: U10.4(A3) ; port QSFP3_MODPRSL_LS
QSFP3_MODSELL: U10.20(B1) ; port QSFP3_MODSELL
QSFP3_MODSELL_LS: R75.2 U10.1(A1) ; port QSFP3_MODSELL_LS
QSFP3_RESETL: U10.18(B2) ; port QSFP3_RESETL
QSFP3_RESETL_LS: U10.3(A2) ; port QSFP3_RESETL_LS
QSFP4_INTL: U11.16(B4) ; port QSFP4_INTL
QSFP4_INTL_LS: U11.5(A4) ; port QSFP4_INTL_LS
QSFP4_LPMODE: U11.15(B5) ; port QSFP4_LPMODE
QSFP4_LPMODE_LS: U11.6(A5) ; port QSFP4_LPMODE_LS
QSFP4_MODPRSL: U11.17(B3) ; port QSFP4_MODPRSL
QSFP4_MODPRSL_LS: U11.4(A3) ; port QSFP4_MODPRSL_LS
QSFP4_MODSELL: U11.20(B1) ; port QSFP4_MODSELL
QSFP4_MODSELL_LS: R74.2 U11.1(A1) ; port QSFP4_MODSELL_LS
QSFP4_RESETL: U11.18(B2) ; port QSFP4_RESETL
QSFP4_RESETL_LS: U11.3(A2) ; port QSFP4_RESETL_LS
QSFP5_INTL: U10.14(B6) ; port QSFP5_INTL
QSFP5_INTL_LS: U10.7(A6) ; port QSFP5_INTL_LS
QSFP5_LPMODE: U10.13(B7) ; port QSFP5_LPMODE
QSFP5_LPMODE_LS: U10.8(A7) ; port QSFP5_LPMODE_LS
QSFP6_INTL: U11.13(B7) ; port QSFP6_INTL
QSFP6_INTL_LS: U11.8(A7) ; port QSFP6_INTL_LS
QSFP6_LPMODE: U11.12(B8) ; port QSFP6_LPMODE
QSFP6_LPMODE_LS: U11.9(A8) ; port QSFP6_LPMODE_LS
QSFP6_MODPRSL: U11.14(B6) ; port QSFP6_MODPRSL
QSFP6_MODPRSL_LS: U11.7(A6) ; port QSFP6_MODPRSL_LS
QSFP6_MODSELL: U10.12(B8) ; port QSFP6_MODSELL
NetC88_2: C88.2 J11.1
NetC89_2: C89.2 J12.1
NetC90_1: C90.1 J13.1
NetC91_2: C91.2 J14.1
NetC92_2: C92.2 J15.1
NetC93_2: C93.2 J16.1
NetC94_2: C94.2 J17.1
NetC95_2: C95.2 J18.1
NetJ1_H28: R76.2 U10.9(A8) ; port QSFP6_MODSELL_LS
NetJ19_4: J19.4(CONFIG1) R81.2
NetJ19_6: J19.6(CONFIG2) R84.2

### Layout directives
differential pair: CONN1_N, CONN1_P, CONN2_N, CONN2_P, CONN3_N, CONN3_P, CONN4_N, CONN4_P, L0_N, L0_P, L1_N, L1_P, L2_N, L2_P, L3_N, L3_P, L4_N, L4_P

### Notes on the sheet
- Mechanical
- (near R82) 485 mA
- Title
- Size:
- Date:
- A4
- Number:
- Time:
- Revision:
- Sheet
- of
- File:
- (in symbol 2170707-4, part G) QSFP28 HEATSINK; 1x6 Cage Assy
- (in symbol Title_Block) Project Title:; Designed by:; Sheet title:; Checked by:; Size:; Number:; Revision:; Date:; Time:; Sheet:; of; BOM:; Variant:

### Library data of the parts
*#10 = Title_Block: Size: *; BOM: *; DW: *; CheckedBy: *
C84-C87 C96 = UMK105B7104KV-FR: as C65 on sheet [08] - QSFP28_2; Supplier 1: Rs; Manufacturer Part Number: UMK105B7104KV-FR; RoHS: Yes; Category: Ceramic Capacitors; Stock 1: 60000; Pricing 1: 10000=0.016 (EUR); Mount: Surface Mount; Case/Package: 0402; Case Code (Imperial): 0402; Case Code (Metric): 1005; Min Operating Temperature: -55°C; Max Operating Temperature: 125°C; Voltage Rating (DC): 50V; Packaging: Tape and Reel; Package Quantity: 1; Dielectric: X7R; Termination: SMD/SMT; Series: M; Length: 0.039inch; Width: 0.02inch; Height: 0.5mm; Thickness: 0.022inch; Lead Free: Lead Free; Halogen Free: Halogen Free; RoHS Compliant: Yes; ComponentLink1URL: https://datasheet.ciiva.com/24356/619umk105b7104kv-fr-24356845.pdf?src-supplier=Onlinecomponents.com; ComponentLink1Description: https://datasheet.ciiva.com/24356/619umk105b7104kv-fr-24356845.pdf?src-supplier=Onlinecomponents.com; ComponentLink2URL: https://datasheet.ciiva.com/30180/52umk105b7104kv-fr-30180098.pdf?src-supplier=Onlinecomponents.com; ComponentLink2Description: https://datasheet.ciiva.com/30180/52umk105b7104kv-fr-30180098.pdf?src-supplier=Onlinecomponents.com; ComponentLink3URL: https://datasheet.ciiva.com/18697/mlcc-all-e-18697452.pdf?src-supplier=Digi-Key; ComponentLink3Description: https://datasheet.ciiva.com/18697/mlcc-all-e-18697452.pdf?src-supplier=Digi-Key; ComponentLink4URL: https://datasheet.ciiva.com/18697/mlcc-all-e-18697451.pdf?src-supplier=Digi-Key; ComponentLink4Description: https://datasheet.ciiva.com/18697/mlcc-all-e-18697451.pdf?src-supplier=Digi-Key; ComponentLink5URL: https://datasheet.ciiva.com/18697/mlcc-all-e-18697453.pdf?src-supplier=Digi-Key; ComponentLink5Description: https://datasheet.ciiva.com/18697/mlcc-all-e-18697453.pdf?src-supplier=Digi-Key; Supplier Part Number 1: 1782869
C88-C95 = C0402C103K3RACTU: Cap Multilayer Ceramic Capacitors MLCC - SMD/SMT 25volts 10000pF X7R 10%; Manufacturer: KEMET; Capacitance: 10nF; Voltage Rating (DC): 25V; Dissipation Factor: 3.5%; Supplier 1: Mouser; Manufacturer Part Number: C0402C103K3RACTU; RoHS: Yes; Category: Ceramic Capacitors; Stock 1: 1004059; Pricing 1: 1=0.1, 10=0.018, 50=0.018, 100=0.008, 1000=0.006, 10000=0.003 (USD); Mount: Surface Mount; Case/Package: 0402; Number of Pins: 2; Case Code (Imperial): 0402; Case Code (Metric): 1005; Min Operating Temperature: -55°C; Max Operating Temperature: 125°C; Tolerance: 10%; Packaging: Tape and Reel; Dielectric: X7R; Voltage Rating: 25V; Package Quantity: 10000; Termination: SMD/SMT; Series: SMD Comm X7R; Construction: Flat; Length: 1mm; Width: 0.5mm; Height: 0.5mm; Depth: 0.5mm; Lead Pitch: 0.3mm; Radiation Hardening: No; RoHS Compliant: Yes; Reach SVHC Compliant: No; ComponentLink1URL: https://datasheet.ciiva.com/7747/kem-c1002-x7r-smd-7747612.pdf?src-supplier=Element14; ComponentLink1Description: https://datasheet.ciiva.com/7747/kem-c1002-x7r-smd-7747612.pdf?src-supplier=Element14; ComponentLink2URL: https://datasheet.ciiva.com/45846/docfinderpartnumberc0402c102k5ractu-45846917.pdf?src-supplier=Onlinecomponents.com; ComponentLink2Description: https://datasheet.ciiva.com/45846/docfinderpartnumberc0402c102k5ractu-45846917.pdf?src-supplier=Onlinecomponents.com; ComponentLink3URL: https://datasheet.ciiva.com/18192/getdatasheetpartid-330802-18192396.pdf?src-supplier=Verical; ComponentLink3Description: https://datasheet.ciiva.com/18192/getdatasheetpartid-330802-18192396.pdf?src-supplier=Verical; Supplier Part Number 1: 80-C0402C103K3R
J4 = 2170707-4: as J4 on sheet [08] - QSFP28_2; Supplier 1: Mouser; Manufacturer Part Number: 2170707-4; RoHS: Yes; Category: Connectors; Stock 1: 60; Pricing 1: 1=80.77, 10=80.77, 50=71.27, 100=70.28, 1000=67.22, 10000=67.22 (USD); ComponentLink1URL: https://www.te.com/commerce/DocumentDelivery/DDEController?Action=srchrtrv&DocNm=2170707&DocType=Customer+Drawing&DocLang=English&src-supplier=Digi-Key; ComponentLink1Description: https://www.te.com/commerce/DocumentDelivery/DDEController?Action=srchrtrv&DocNm=2170707&DocType=Customer+Drawing&DocLang=English&src-supplier=Digi-Key
J11-J18 = SMA-J-P-H-ST-EM1: RF Connectors / Coaxial Connectors 6 GHz, 50 Ohm SMA Jack or Plug, Cable Connector; Manufacturer: Samtec; Body Material: Brass; Body Plating: Gold; Dielectric Material: PTFE; Impedance: 50R; Max Frequency: 20GHz; Voltage Rating: 335V; Number of Ports: 1; Number of Contacts: 1NUMBER; Supplier 1: Rs; Manufacturer Part Number: SMA-J-P-H-ST-EM1; RoHS: Yes; Category: RF / Coaxial Connectors; Stock 1: 33; Pricing 1: 1=5.76, 10=4.18, 50=3.98, 100=3.83, 500=2.76 (EUR); Mount: Edge,Board; Case/Package: SMA; Contact Material: Copper; Contact Plating: Gold; Housing Color: Gold; Insulation Material: Polytetrafluoroethylene; Center Contact Plating: Gold; Min Operating Temperature: -65°C; Max Operating Temperature: 125°C; Termination: Solder; Orientation: Straight; Packaging: Tray; Package Quantity: 1; Fastening Type: Threaded; Connector Type: SMA; Series: -; Frequency: 20GHz; Length: 6.35mm; Depth: 13.33mm; Radiation Hardening: No; RoHS Compliant: Yes; ComponentLink1URL: https://datasheet.ciiva.com/646/sma-j-p-x-st-em1-mkt-646053.pdf?src-supplier=Digikey; ComponentLink1Description: https://datasheet.ciiva.com/646/sma-j-p-x-st-em1-mkt-646053.pdf?src-supplier=Digikey; Supplier Part Number 1: 1592304
J19 = 47272-0029: Conn Display Port RCP 20 POS 1mm Solder RA SMD 20 Terminal 1 Port T/R; Manufacturer: Molex; Supplier 1: Farnell; Manufacturer Part Number: 47272-0029; RoHS: Yes; Category: Audio / Video Connectors; Stock 1: 941; Pricing 1: 1=5.3, 10=4.34, 100=3.83, 250=3.35, 500=3.26, 1000=2.77 (EUR); ComponentLink1URL: http://www.molex.com/pdm_docs/sd/472720029_sd.pdf?src-supplier=Mouser; ComponentLink1Description: http://www.molex.com/pdm_docs/sd/472720029_sd.pdf?src-supplier=Mouser; Supplier Part Number 1: 3911167; Parameter 1: *
MH1-MH4 = MH_250H125: MOUNTING HOLE, 125 HOLE 250 PAD
MRB?#1-MRB?#4 = 720: Keyway Punch, Nibbler, 1/8"& 3/16"Keyways, 7/8"& 1-7/32"Pushbutton Holes; Manufacturer: Keystone Electronics; Supplier 1: Farnell; Manufacturer Part Number: 720; RoHS: Yes; Category: Hardware, Fasteners; Stock 1: 13244; Pricing 1: 10=0.269, 50=0.227, 100=0.202, 500=0.176 (EUR); ComponentLink1URL: https://datasheet.ciiva.com/7654/1718272-7654348.pdf?src-supplier=Element14; ComponentLink1Description: https://datasheet.ciiva.com/7654/1718272-7654348.pdf?src-supplier=Element14; ComponentLink2URL: https://datasheet.ciiva.com/18415/70182492-18415734.pdf?src-supplier=Allied+Electronics; ComponentLink2Description: https://datasheet.ciiva.com/18415/70182492-18415734.pdf?src-supplier=Allied+Electronics; ComponentLink3URL: https://datasheet.ciiva.com/6946/m60p130-6946767.pdf?src-supplier=Newark; ComponentLink3Description: https://datasheet.ciiva.com/6946/m60p130-6946767.pdf?src-supplier=Newark; Supplier Part Number 1: 1651664
MSO?#1-MSO?#4 = 1892: 1892 Miniature Bayonet Base Bulb - T-31/4 Type - 14.4V .12A; Manufacturer: Keystone Electronics; Supplier 1: Mouser; Manufacturer Part Number: 1892; RoHS: Yes; Category: Spacers, Standoffs; Stock 1: 27076; Pricing 1: 1=0.35, 10=0.35, 50=0.307, 100=0.261, 1000=0.186, 10000=0.139 (USD); ComponentLink1URL: https://datasheet.ciiva.com/22625/1703936-22625205.pdf?src-supplier=Element14; ComponentLink1Description: https://datasheet.ciiva.com/22625/1703936-22625205.pdf?src-supplier=Element14; ComponentLink2URL: https://datasheet.ciiva.com/1396/1703936-1396590.pdf?src-supplier=Newark; ComponentLink2Description: https://datasheet.ciiva.com/1396/1703936-1396590.pdf?src-supplier=Newark; ComponentLink3URL: https://datasheet.ciiva.com/14533/70182342-14533134.pdf?src-supplier=Allied+Electronics; ComponentLink3Description: https://datasheet.ciiva.com/14533/70182342-14533134.pdf?src-supplier=Allied+Electronics; ComponentLink4URL: https://datasheet.ciiva.com/16302/m60-2p71-16302745.pdf?src-supplier=Future+Electronics; ComponentLink4Description: https://datasheet.ciiva.com/16302/m60-2p71-16302745.pdf?src-supplier=Future+Electronics; Supplier Part Number 1: 534-1892
R74-R76 R81 R83 R84 = ERJ-2RKF4991X: as R65-R73 on sheet [08] - QSFP28_2; Supplier 1: Mouser; Manufacturer Part Number: ERJ-2RKF4991X; RoHS: Yes; Category: Chip SMD Resistors; Stock 1: 1218727; Pricing 1: 1=0.1, 10=0.018, 50=0.018, 100=0.008, 1000=0.006, 10000=0.004 (USD); Mount: Surface Mount; Case/Package: 0402; Case Code (Metric): 1005; Case Code (Imperial): 0402; Contact Plating: Tin; Weight: 2.8E-05oz; Min Operating Temperature: -55°C; Max Operating Temperature: 155°C; Tolerance: 1%; Packaging: Tape and Reel; Package Quantity: 1; Resistor Type: Thick Film; Number of Terminations: 2; Termination: SMD/SMT; Max Power Dissipation: 100mW; Voltage Rating (DC): 50V; Features: Automotive AEC-Q200; Series: ERJ; Resistance Tolerance: 1%; Construction: Rectangular; Working Voltage: 50V; Technology: THICK FILM; Length: 1mm; Width: 0.5mm; Height: 0.016inch; Depth: 0.5mm; Radiation Hardening: No; Reach SVHC Compliant: No; Military Standard: Not; Lead Free: Lead Free; RoHS Compliant: Yes; ComponentLink1URL: https://datasheet.ciiva.com/46388/426256-46388311.pdf?src-supplier=Element14; ComponentLink1Description: https://datasheet.ciiva.com/46388/426256-46388311.pdf?src-supplier=Element14; ComponentLink2URL: https://datasheet.ciiva.com/46376/426256-46376955.pdf?src-supplier=Element14; ComponentLink2Description: https://datasheet.ciiva.com/46376/426256-46376955.pdf?src-supplier=Element14; ComponentLink3URL: https://datasheet.ciiva.com/22749/1678782-22749654.pdf?src-supplier=Element14; ComponentLink3Description: https://datasheet.ciiva.com/22749/1678782-22749654.pdf?src-supplier=Element14; ComponentLink4URL: https://datasheet.ciiva.com/24158/aoa0000ce2-24158871.pdf?src-supplier=Mouser; ComponentLink4Description: https://datasheet.ciiva.com/24158/aoa0000ce2-24158871.pdf?src-supplier=Mouser; ComponentLink5URL: https://datasheet.ciiva.com/16775/70260748-16775018.pdf?src-supplier=Allied+Electronics; ComponentLink5Description: https://datasheet.ciiva.com/16775/70260748-16775018.pdf?src-supplier=Allied+Electronics; ComponentLink6URL: https://datasheet.ciiva.com/16773/70260748-16773110.pdf?src-supplier=Allied+Electronics; ComponentLink6Description: https://datasheet.ciiva.com/16773/70260748-16773110.pdf?src-supplier=Allied+Electronics; ComponentLink7URL: https://datasheet.ciiva.com/16199/aoa0000ce2-16199546.pdf?src-supplier=Future+Electronics; ComponentLink7Description: https://datasheet.ciiva.com/16199/aoa0000ce2-16199546.pdf?src-supplier=Future+Electronics; Supplier Part Number 1: 667-ERJ-2RKF4991X
R77-R80 = ERJ-2RKF1000X: RES Thick Film 0402 100 Ohm 1% 1/10W 100ppm/C Molded SMD Punched Carrier T/R; Manufacturer: Panasonic; Resistance: 100R; Temperature Coefficient: 100ppm/°C; Power Rating: 100mW; Voltage Rating: 50V; Supplier 1: Mouser; Manufacturer Part Number: ERJ-2RKF1000X; RoHS: Yes; Category: Chip SMD Resistors; Stock 1: 11989335; Pricing 1: 1=0.1, 10=0.017, 50=0.017, 100=0.008, 1000=0.006, 10000=0.004 (USD); Mount: Surface Mount; Case/Package: 0402; Number of Pins: 2; Contact Plating: Tin; Case Code (Imperial): 0402; Case Code (Metric): 1005; Size Code: 0402; Min Operating Temperature: -55°C; Max Operating Temperature: 155°C; Tolerance: 1%; Resistor Type: Thick Film; Packaging: Tape and Reel; Package Quantity: 1; Termination: SMD/SMT; Number of Terminations: 2; Max Power Dissipation: 100mW; Voltage Rating (DC): 50V; Features: Automotive AEC-Q200; Series: ERJ; Technology: THICK FILM; Resistance Tolerance: 1%; Construction: Rectangular; Length: 1mm; Width: 0.5mm; Height: 0.35mm; Depth: 0.5mm; Radiation Hardening: No; Reach SVHC Compliant: No; Military Standard: Not; Lead Free: Lead Free; RoHS Compliant: Yes; ComponentLink1URL: https://datasheet.ciiva.com/27056/2007311-27056035.pdf?src-supplier=Jameco; ComponentLink1Description: https://datasheet.ciiva.com/27056/2007311-27056035.pdf?src-supplier=Jameco; ComponentLink2URL: https://datasheet.ciiva.com/11821/0900766b80f80784-11821173.pdf?src-supplier=Rs; ComponentLink2Description: https://datasheet.ciiva.com/11821/0900766b80f80784-11821173.pdf?src-supplier=Rs; ComponentLink3URL: https://datasheet.ciiva.com/7830/426256-7830973.pdf?src-supplier=Element14; ComponentLink3Description: https://datasheet.ciiva.com/7830/426256-7830973.pdf?src-supplier=Element14; ComponentLink4URL: https://datasheet.ciiva.com/43467/1678782-43467223.pdf?src-supplier=Farnell; ComponentLink4Description: https://datasheet.ciiva.com/43467/1678782-43467223.pdf?src-supplier=Farnell; ComponentLink5URL: https://datasheet.ciiva.com/28514/1678782-28514175.pdf?src-supplier=Element14; ComponentLink5Description: https://datasheet.ciiva.com/28514/1678782-28514175.pdf?src-supplier=Element14; ComponentLink6URL: https://datasheet.ciiva.com/46372/1678782-46372741.pdf?src-supplier=Element14; ComponentLink6Description: https://datasheet.ciiva.com/46372/1678782-46372741.pdf?src-supplier=Element14; ComponentLink7URL: https://datasheet.ciiva.com/16776/70260748-16776427.pdf?src-supplier=Allied+Electronics; ComponentLink7Description: https://datasheet.ciiva.com/16776/70260748-16776427.pdf?src-supplier=Allied+Electronics; ComponentLink8URL: https://datasheet.ciiva.com/9186/aoa0000ce2-9186683.pdf?src-supplier=Avnet; ComponentLink8Description: https://datasheet.ciiva.com/9186/aoa0000ce2-9186683.pdf?src-supplier=Avnet; ComponentLink9URL: https://datasheet.ciiva.com/16199/aoa0000ce2-16199575.pdf?src-supplier=Future+Electronics; ComponentLink9Description: https://datasheet.ciiva.com/16199/aoa0000ce2-16199575.pdf?src-supplier=Future+Electronics; ComponentLink10URL: https://datasheet.ciiva.com/48531/aoa0000ce2-48531067.pdf?src-supplier=Avnet; ComponentLink10Description: https://datasheet.ciiva.com/48531/aoa0000ce2-48531067.pdf?src-supplier=Avnet; ComponentLink11URL: https://datasheet.ciiva.com/30260/aoa0000ce2-30260809.pdf?src-supplier=Onlinecomponents.com; ComponentLink11Description: https://datasheet.ciiva.com/30260/aoa0000ce2-30260809.pdf?src-supplier=Onlinecomponents.com; Supplier Part Number 1: 667-ERJ-2RKF1000X
R82 = CRCW25126R80FKEGHP: SMD Chip Resistor, 6.8 Ohm, ± 1%, 1.5 W, 2512 [6332 Metric], Thick Film, High Power Pulse Proof; Manufacturer: Vishay Dale; Supplier 1: Farnell; Manufacturer Part Number: CRCW25126R80FKEGHP; RoHS: Yes; Category: Chip SMD Resistors; Stock 1: 1935; Pricing 1: 5=0.533, 50=0.327, 250=0.305, 500=0.282, 1000=0.277, 2000=0.273, 10000=0.268, 20000=0.263 (EUR); ComponentLink1URL: https://datasheet.ciiva.com/2615/crcwhpe3-2615657.pdf?src-supplier=Digikey; ComponentLink1Description: https://datasheet.ciiva.com/2615/crcwhpe3-2615657.pdf?src-supplier=Digikey; ComponentLink2URL: https://datasheet.ciiva.com/9060/crcwhpe3-9060927.pdf?src-supplier=Avnet; ComponentLink2Description: https://datasheet.ciiva.com/9060/crcwhpe3-9060927.pdf?src-supplier=Avnet; Supplier Part Number 1: 3546537
U10 U11 = TXS0108EPWR: as U8 on sheet [08] - QSFP28_2; Supplier 1: Mouser; Manufacturer Part Number: TXS0108EPWR; RoHS: Yes; Category: Voltage Level Shifters; Stock 1: 220045; Pricing 1: 1=1.57, 10=1.41, 50=1.33, 100=1.13, 1000=0.772, 10000=0.702 (USD); Mount: Surface Mount; Case/Package: TSSOP; Number of Pins: 20; Weight: 0.002716oz; Min Operating Temperature: -40°C; Max Operating Temperature: 85°C; Packaging: Tape and Reel; Series: -; Number of Channels: 8; Logic Function: Translator; Number of Inputs: 8; Package Quantity: 2000; Termination: SMD/SMT; Radiation Hardening: No; Lead Free: Lead Free; RoHS Compliant: Yes; Reach SVHC Compliant: No; ComponentLink1URL: https://datasheet.ciiva.com/14287/txs0108e-14287280.pdf?src-supplier=Farnell; ComponentLink1Description: https://datasheet.ciiva.com/14287/txs0108e-14287280.pdf?src-supplier=Farnell; ComponentLink2URL: https://datasheet.ciiva.com/28653/1714661-28653429.pdf?src-supplier=Element14; ComponentLink2Description: https://datasheet.ciiva.com/28653/1714661-28653429.pdf?src-supplier=Element14; ComponentLink3URL: https://datasheet.ciiva.com/4834/sces642b-127094-4834401.pdf?src-supplier=Mouser; ComponentLink3Description: https://datasheet.ciiva.com/4834/sces642b-127094-4834401.pdf?src-supplier=Mouser; ComponentLink4URL: https://datasheet.ciiva.com/15096/getdatasheetpartid-322119-15096276.pdf?src-supplier=Verical; ComponentLink4Description: https://datasheet.ciiva.com/15096/getdatasheetpartid-322119-15096276.pdf?src-supplier=Verical; ComponentLink5URL: https://datasheet.ciiva.com/1508/1815244-1508732.pdf?src-supplier=Element14; ComponentLink5Description: https://datasheet.ciiva.com/1508/1815244-1508732.pdf?src-supplier=Element14; ComponentLink6URL: https://datasheet.ciiva.com/1899/txs0108e-1899605.pdf?src-supplier=Digi-Key; ComponentLink6Description: https://datasheet.ciiva.com/1899/txs0108e-1899605.pdf?src-supplier=Digi-Key; ComponentLink7URL: https://datasheet.ciiva.com/1899/txs0108e-1899604.pdf?src-supplier=Digi-Key; ComponentLink7Description: https://datasheet.ciiva.com/1899/txs0108e-1899604.pdf?src-supplier=Digi-Key; ComponentLink8URL: https://datasheet.ciiva.com/1899/txs0108e-1899606.pdf?src-supplier=Digi-Key; ComponentLink8Description: https://datasheet.ciiva.com/1899/txs0108e-1899606.pdf?src-supplier=Digi-Key; ComponentLink9URL: https://datasheet.ciiva.com/14287/txs0108e-14287532.pdf?src-supplier=Avnet; ComponentLink9Description: https://datasheet.ciiva.com/14287/txs0108e-14287532.pdf?src-supplier=Avnet